# EAGLE design voice_caller (EAGLE 7.7.0)
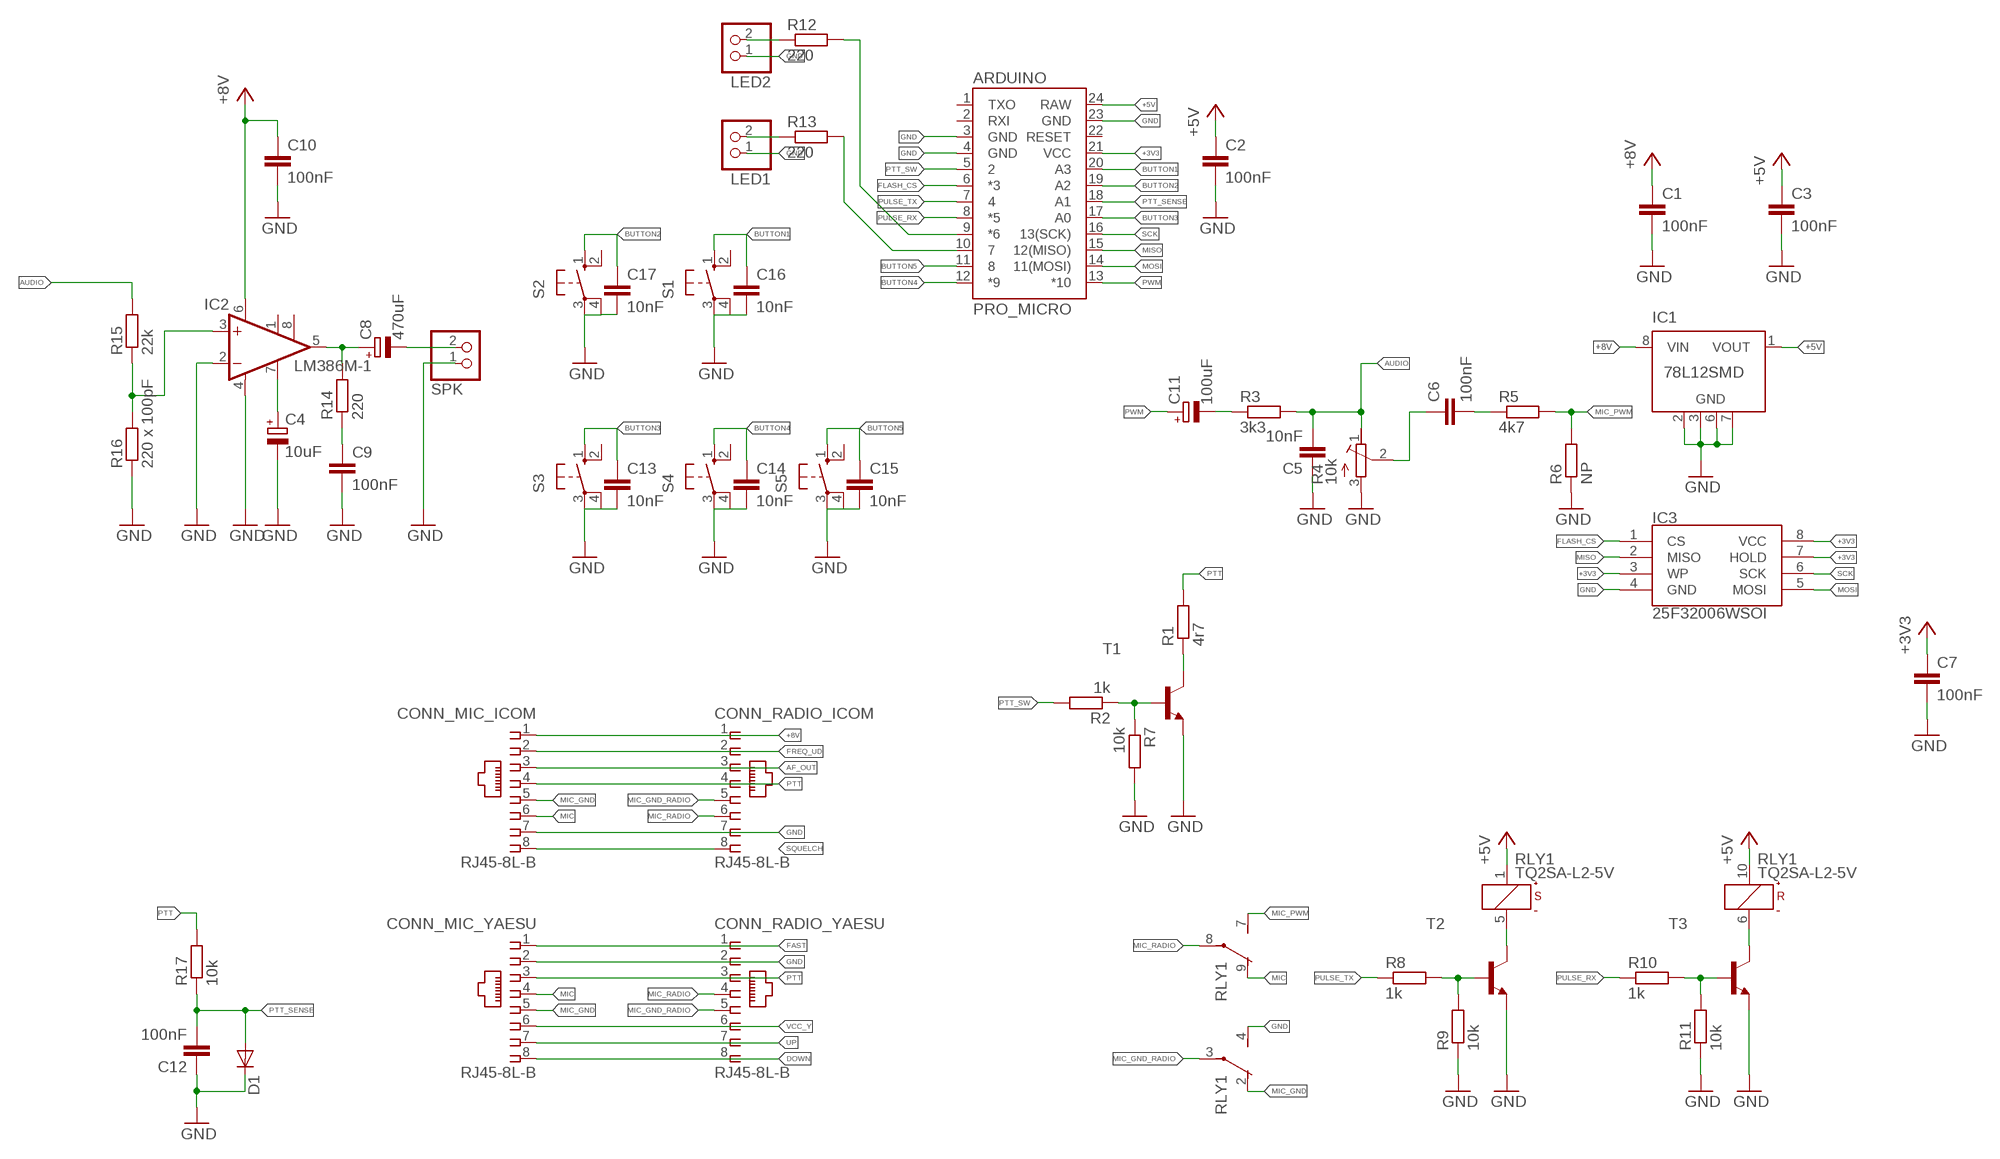
[diagram p0: schematic, sheet 1]

## Parts
ARDUINO  PRO_MICRO  SPARKFUN_PRO_MICRO  [SPARKFUN_PRO_MICRO]
C1  100nF  C-EUC1206K  [C1206K]
C2  100nF  C-EUC1206K  [C1206K]
C3  100nF  C-EUC1206K  [C1206K]
C4  10uF  CPOL-EUE2.5-6  [E2,5-6]
C5  10nF  C-EUC1206K  [C1206K]
C6  100nF  C-EUC1206K  [C1206K]
C7  100nF  C-EUC1206K  [C1206K]
C8  470uF  CPOL-EUE2.5-6  [E2,5-6]
C9  100nF  C-EUC1206K  [C1206K]
C10  100nF  C-EUC1206K  [C1206K]
C11  100uF  CPOL-EUE2.5-6  [E2,5-6]
C12  100nF  C-EUC1206K  [C1206K]
C13  10nF  C-EUC1206K  [C1206K]
C14  10nF  C-EUC1206K  [C1206K]
C15  10nF  C-EUC1206K  [C1206K]
C16  10nF  C-EUC1206K  [C1206K]
C17  10nF  C-EUC1206K  [C1206K]
CONN_MIC_ICOM  RJ45-8L-B  [RJ45-NO-SHIELD]
CONN_MIC_YAESU  RJ45-8L-B  [RJ45-NO-SHIELD]
CONN_RADIO_ICOM  RJ45-8L-B  [RJ45-NO-SHIELD]
CONN_RADIO_YAESU  RJ45-8L-B  [RJ45-NO-SHIELD]
D1  DIODE-SOD80C  [SOD80C]
IC1  78L12SMD  [SO08]
IC2  LM386M-1  [SO08]
IC3  25F32006WSOI  SPI_FLASH-X25XXSMD1  [SO08-EIAJ]
LED1  PINHD-1X2  [1X02]
LED2  PINHD-1X2  [1X02]
R1  4r7  R-EU_M1206  [M1206]
R2  1k  R-EU_M1206  [M1206]
R3  3k3  R-EU_M1206  [M1206]
R4  10k  R-TRIMMT93XB  [RTRIMT93XB]
R5  4k7  R-EU_M1206  [M1206]
R6  NP  R-EU_M1206  [M1206]
R7  10k  R-EU_M1206  [M1206]
R8  1k  R-EU_M1206  [M1206]
R9  10k  R-EU_M1206  [M1206]
R10  1k  R-EU_M1206  [M1206]
R11  10k  R-EU_M1206  [M1206]
R12  220  R-EU_M1206  [M1206]
R13  220  R-EU_M1206  [M1206]
R14  220  R-EU_M1206  [M1206]
R15  22k  R-EU_M1206  [M1206]
R16  220 x 100pF  R-EU_M1206  [M1206]
R17  10k  R-EU_M1206  [M1206]
RLY1  TQ2SA-L2-5V  [TQ-SA]
S1  10-XX  [B3F-10XX]
S2  10-XX  [B3F-10XX]
S3  10-XX  [B3F-10XX]
S4  10-XX  [B3F-10XX]
S5  10-XX  [B3F-10XX]
SPK  PINHD-1X2  [1X02]
T1  MMBT3904LT1-NPN-SOT23-BEC  [SOT23-BEC]
T2  MMBT3904LT1-NPN-SOT23-BEC  [SOT23-BEC]
T3  MMBT3904LT1-NPN-SOT23-BEC  [SOT23-BEC]

## Nets
+3V3: ARDUINO.21(VCC) C7.1 IC3.3(WP) IC3.7(HOLD) IC3.8(VCC)
+5V: ARDUINO.24(RAW) C2.1 C3.1 IC1.1(VOUT) RLY1.1(S:+) RLY1.10(R:+)
+8V: C1.1 C10.1 CONN_MIC_ICOM.1 CONN_RADIO_ICOM.1 IC1.8(VIN) IC2.6(VS)
AF_OUT: CONN_MIC_ICOM.3 CONN_RADIO_ICOM.3
AUDIO: C5.2 R3.2 R4.1(E) R15.2
BUTTON1: ARDUINO.20(A3) C16.1 S1.1(S)
BUTTON2: ARDUINO.19(A2) C17.1 S2.1(S)
BUTTON3: ARDUINO.17(A0) C13.1 S3.1(S)
BUTTON4: ARDUINO.12(*9) C14.1 S4.1(S)
BUTTON5: ARDUINO.11 C15.1 S5.1(S)
DOWN: CONN_MIC_YAESU.8 CONN_RADIO_YAESU.8
FAST: CONN_MIC_YAESU.1 CONN_RADIO_YAESU.1
FLASH_CS: ARDUINO.6(*3) IC3.1(CS)
FREQ_UD: CONN_MIC_ICOM.2 CONN_RADIO_ICOM.2
GND: ARDUINO.3(GND) ARDUINO.4(GND) ARDUINO.23(GND) C1.2 C2.2 C3.2 C4.- C5.1 C7.2 C9.2 C10.2 C12.1 C13.2 C14.2 C15.2 C16.2 C17.2 CONN_MIC_ICOM.7 CONN_MIC_YAESU.2 CONN_RADIO_ICOM.7 CONN_RADIO_YAESU.2 D1.C IC1.2(GND) IC1.3(GND) IC1.6(GND) IC1.7(GND) IC2.2(-IN) IC2.4(GND) IC3.4(GND) LED1.1 LED2.1 R4.3(A) R6.1 R7.2 R9.1 R11.1 R16.1 RLY1.4(1:S) S1.3(P) S1.4(P1) S2.3(P) S2.4(P1) S3.3(P) S3.4(P1) S4.3(P) S4.4(P1) S5.3(P) S5.4(P1) SPK.1 T1.E T2.E T3.E
MIC: CONN_MIC_ICOM.6 CONN_MIC_YAESU.4 RLY1.9(2:O)
MIC_GND: CONN_MIC_ICOM.5 CONN_MIC_YAESU.5 RLY1.2(1:O)
MIC_GND_RADIO: CONN_RADIO_ICOM.5 CONN_RADIO_YAESU.5 RLY1.3(1:P)
MIC_PWM: R5.2 R6.2 RLY1.7(2:S)
MIC_RADIO: CONN_RADIO_ICOM.6 CONN_RADIO_YAESU.4 RLY1.8(2:P)
MISO: ARDUINO.15(12(MISO)) IC3.2(MISO)
MOSI: ARDUINO.14(11(MOSI)) IC3.5(MOSI)
N$1: C11.- R3.1
N$2: IC2.3(+IN) R15.1 R16.2
N$3: C6.2 R5.1
N$4: LED2.2 R12.1
N$5: R2.1 R7.1 T1.B
N$6: C6.1 R4.2(S)
N$7: C4.+ IC2.7(BYPASS)
N$8: R1.1 T1.C
N$9: LED1.2 R13.1
N$10: RLY1.5(S:-) T2.C
N$11: R8.2 R9.2 T2.B
N$12: ARDUINO.9(*6) R12.2
N$13: RLY1.6(R:-) T3.C
N$14: R10.2 R11.2 T3.B
N$15: ARDUINO.10 R13.2
N$16: C8.+ IC2.5(OUT) R14.2
N$21: C9.1 R14.1
N$22: C8.- SPK.2
PTT: CONN_MIC_ICOM.4 CONN_MIC_YAESU.3 CONN_RADIO_ICOM.4 CONN_RADIO_YAESU.3 R1.2 R17.2
PTT_SENSE: ARDUINO.18(A1) C12.2 D1.A R17.1
PTT_SW: ARDUINO.5 R2.2
PULSE_RX: ARDUINO.8(*5) R10.1
PULSE_TX: ARDUINO.7 R8.1
PWM: ARDUINO.13(*10) C11.+
SCK: ARDUINO.16(13(SCK)) IC3.6(SCK)
SQUELCH: CONN_MIC_ICOM.8 CONN_RADIO_ICOM.8
UP: CONN_MIC_YAESU.7 CONN_RADIO_YAESU.7
VCC_Y: CONN_MIC_YAESU.6 CONN_RADIO_YAESU.6
Unconnected: ARDUINO.1(TXO) ARDUINO.2(RXI) ARDUINO.22(RESET) IC1.4(NC) IC1.5(NC) IC2.1(GAIN) IC2.8(GAIN) S1.2(S1) S2.2(S1) S3.2(S1) S4.2(S1) S5.2(S1)

## Library data of the parts
ARDUINO = SparkFun-Boards:SPARKFUN_PRO_MICRO: SparkFun Pro Micro Atmega32U4 compatible footprint. SparkFun Products: 3.3V/8MHz <https://www.sparkfun.com/products/12587> 5V/16MHz <https://www.sparkfun.com/products/12640>
C1-C3 C5-C7 C9 C10 C12-C17 = rcl:C-EU: CAPACITOR, European symbol
C4 C8 C11 = rcl:CPOL-EU: POLARIZED CAPACITOR, European symbol
CONN_MIC_ICOM CONN_MIC_YAESU CONN_RADIO_ICOM CONN_RADIO_YAESU = con-tycoelectronics:RJ45: CORCOM Modular RJ Jacks No Shield Source: www.tycoelectronics.com .. ENG_DS_1654001_1099_RJ_L_0507.pdf; MF: TYCO ELECTRONICS; MPN: RJ45-8L-B; OC_FARNELL: 1279843; OC_NEWARK: 52K4445
D1 = diode:DIODE-: DIODE
IC1 = linear:78L*SMD: Positive VOLTAGE REGULATOR
IC2 = linear:LM386?-*: Low Voltage Audio Power Amplifier Source: http://cache.national.com/ds/LM/LM386.pdf
IC3 = SparkFun-IC-Memory:SPI_FLASH-X25XX: 32M Serial Flash Memory 8pin SPI Flash series x25xx. Works with devices like W25X32 and BR25L32 Datasheet <http://www.macronix.com/Lists/Datasheet/Attachments/5031/MX25L3206E,%203V,%2032Mb,%20v1.5.pdf> SparkFun Products SparkFun Venus GPS Logger <https://www.sparkfun.com/products/10920> (GPS-10920); PROD_ID: IC-09109
LED1 LED2 SPK = pinhead:PINHD-1X2: PIN HEADER
R1-R3 R5-R17 = rcl:R-EU_: RESISTOR, European symbol
R4 = rcl:R-TRIMM: Trimm resistor
RLY1 = relay:TQ2?-L2-*: LOW PROFILE 2 FORM C RELAY NAiS 2 coil latching Source: http://www.mew-europe.com/.. en_ds_61020_0001.pdf Source: http://www.mew-europe.com/.. en_ds_61020_0002.pdf; MF: AROMAT/ MATSUSHITA; MPN: TQ2SA-L2-5V; OC_FARNELL: 625760; OC_NEWARK: 64K3202
S1-S5 = switch-omron:10-XX: OMRON SWITCH; MPN: B3F-1000; OC_FARNELL: 176432; OC_NEWARK: 36M3542
T1-T3 = transistor:*-NPN-: NPN Transistror BF959 corrected 2008.03.06

## Board
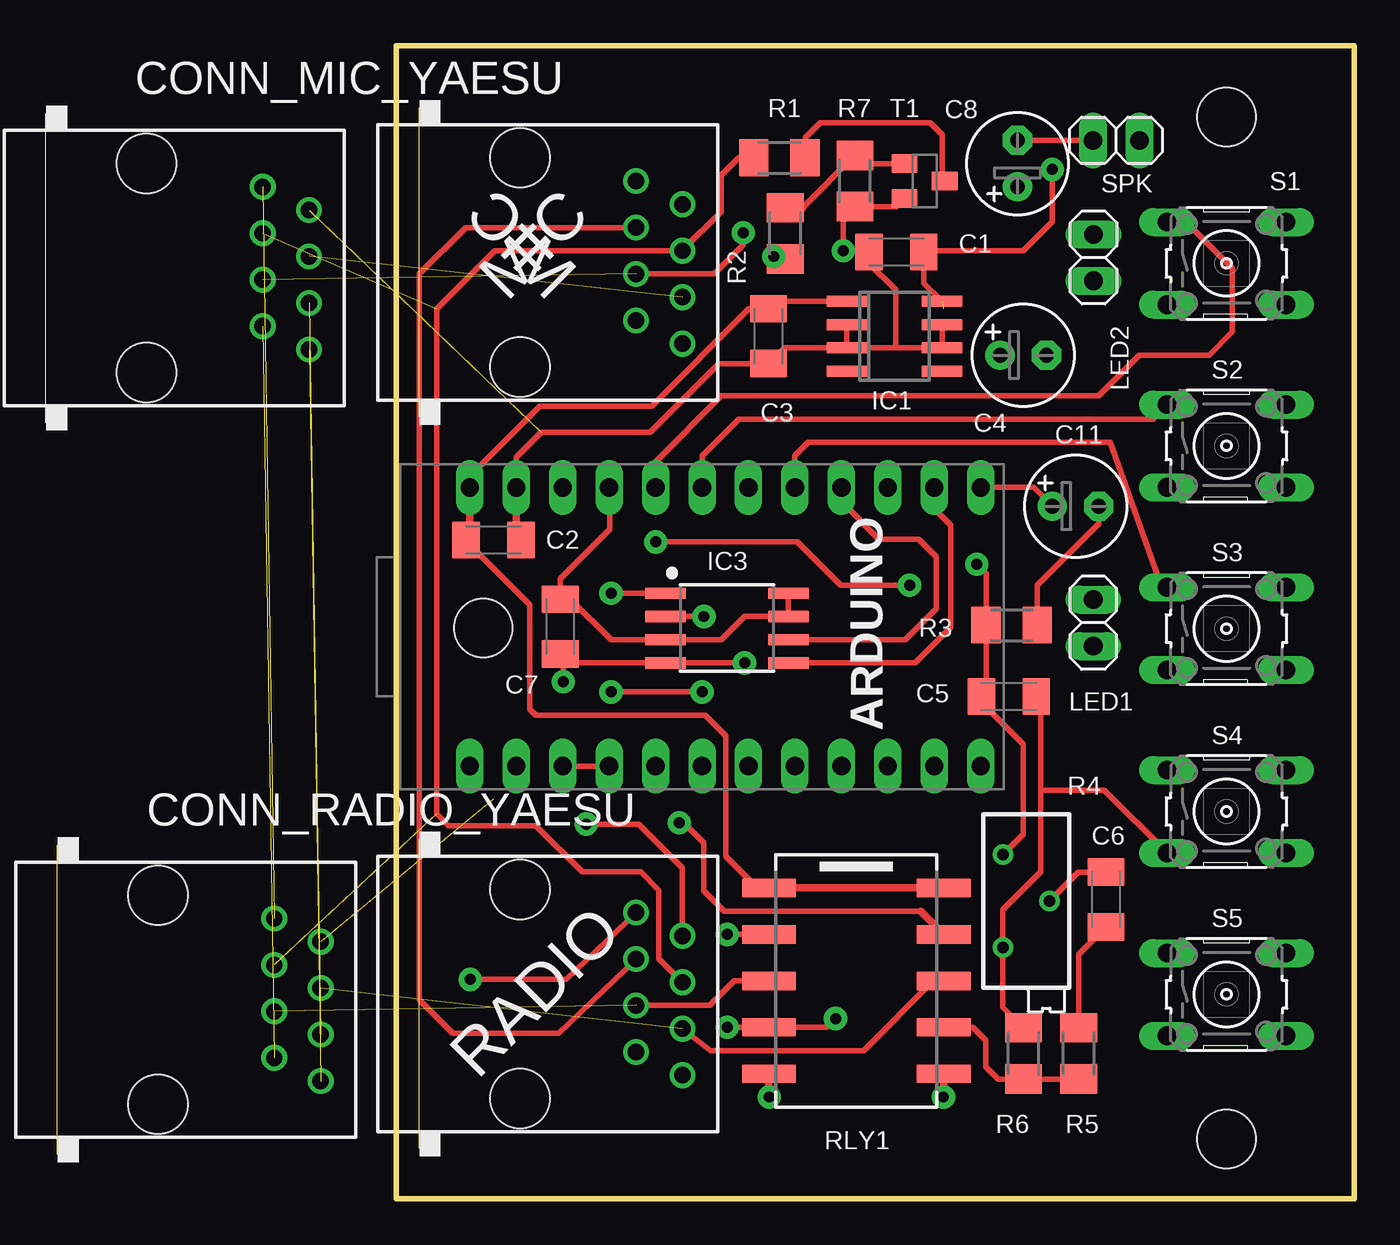
[diagram p1: board, top side]
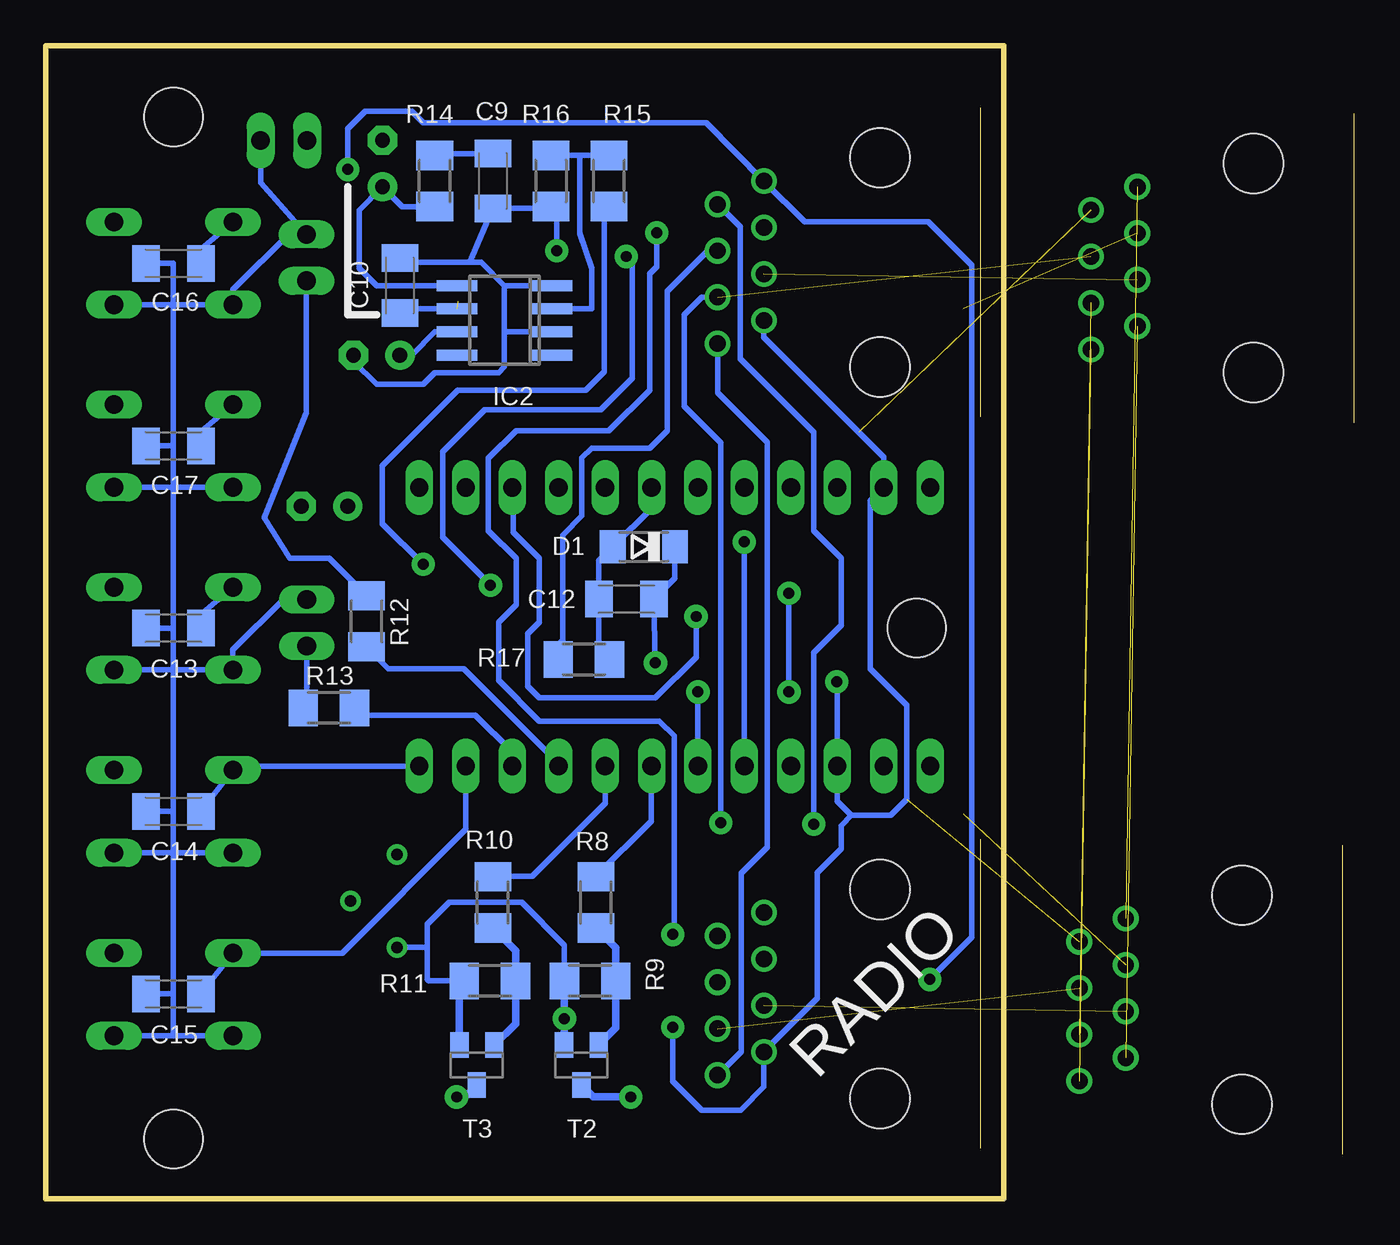
[diagram p2: board, bottom side, seen from below]

Size 52.39 x 63.05 mm. Coordinates in mm from the lower left corner, seen from the top.
Outline: 0,63.05 0,0 52.39,0 52.39,63.05 0,63.05
Copper layers (1*16): Top 0.035mm / dielectric 1.5mm / Bottom 0.035mm
Design rules "default *": minimum track width 10mil, minimum drill 0.6mm, track to track 8mil, track to pad 8mil, pad to pad 8mil, via to via 8mil, smd to smd 0mil, copper to edge 20mil, drill to drill 8mil, minimum pad ring 10mil, minimum via ring 8mil, stop-mask expansion 4mil, vias tented up to drill 0mil, thermal gap 10mil
Holes 3.2 mm at 45.4,3.27 45.4,59.15 4.76,31.21

### Footprints (pad centres in the part's own frame; a part is rotated, then mirrored left to right if it is on the bottom)
SPARKFUN_PRO_MICRO = drill 1 long: 1 -7.62,12.7; 2 -7.62,10.16; 3 -7.62,7.62; 4 -7.62,5.08; 5 -7.62,2.54; 6 -7.62,0; 7 -7.62,-2.54; 8 -7.62,-5.08; 9 -7.62,-7.62; 10 -7.62,-10.16; 11 -7.62,-12.7; 12 -7.62,-15.24; 13 7.62,-15.24; 14 7.62,-12.7; 15 7.62,-10.16; 16 7.62,-7.62; 17 7.62,-5.08; 18 7.62,-2.54; 19 7.62,0; 20 7.62,2.54; 21 7.62,5.08; 22 7.62,7.62; 23 7.62,10.16; 24 7.62,12.7
C1206K = smd 1.5 x 2: 1 -1.5,0; 2 1.5,0
E2,5-6 = drill 0.813 pad 1.6: + -1.27,0 | drill 0.813 pad 1.6 octagon: - 1.27,0
RJ45-NO-SHIELD = drill 0.9 pad 1.4: 1 -4.445,6.35; 2 -3.175,8.89; 3 -1.905,6.35; 4 -0.635,8.89; 5 0.635,6.35; 6 1.905,8.89; 7 3.175,6.35; 8 4.445,8.89 | hole 3.251: -5.715,0; 5.715,0
SOD80C = smd 1.4 x 1.8: A 1.7,0; C -1.7,0
SO08 = smd 0.6 x 2.2: 1 -1.905,-2.6; 2 -0.635,-2.6; 3 0.635,-2.6; 4 1.905,-2.6; 5 1.905,2.6; 6 0.635,2.6; 7 -0.635,2.6; 8 -1.905,2.6
SO08-EIAJ = smd 0.61 x 2.21: 1 -1.905,-3.378; 2 -0.635,-3.378; 3 0.635,-3.378; 4 1.905,-3.378; 5 1.905,3.353; 6 0.635,3.353; 7 -0.635,3.353; 8 -1.905,3.353
1X02 = drill 1.016 long: 1 -1.27,0; 2 1.27,0
M1206 = smd 1.6 x 2: 1 -1.4,0; 2 1.4,0
RTRIMT93XB = drill 0.61: 1 1.27,-2.54; 2 -1.27,0; 3 1.27,2.54
TQ-SA = smd 1 x 2.94: 1 -5.08,-4.78; 2 -2.54,-4.78; 3 0,-4.78; 4 2.54,-4.78; 5 5.08,-4.78; 6 5.08,4.78; 7 2.54,4.78; 8 0,4.78; 9 -2.54,4.78; 10 -5.08,4.78
B3F-10XX = drill 1.016 long: 1 -3.251,2.261; 2 3.251,2.261; 3 -3.251,-2.261; 4 3.251,-2.261
SOT23-BEC = smd 1 x 1.4: B -0.95,-1.1; C 0,1.1; E 0.95,-1.1

### Placement (x,y rotation side)
ARDUINO  16.72,31.29 90 top
C1  27.35,51.78 180 top
C2  5.33,36.04 0 top
C3  20.36,47.17 270 top
C4  34.29,46.13 0 top
C5  33.5,27.48 180 top
C6  38.81,16.37 270 top
C7  8.97,31.29 270 top
C8  220uF  [E2,5-6]  33.97,56.61 90 top
C9  27.94,55.66 270 bottom
C10  33.02,49.94 90 bottom
C11  220uF  [E2,5-6]  37.15,37.88 0 top
C12  20.64,32.8 180 bottom
C13  45.4,31.21 180 bottom
C14  45.4,21.19 180 bottom
C15  45.4,11.21 180 bottom
C16  45.4,51.15 180 bottom
C17  45.4,41.17 180 bottom
CONN_MIC_ICOM  6.76,51.21 270 top
CONN_MIC_YAESU  -13.65,50.89 270 top  (outside the outline)
CONN_RADIO_ICOM  6.76,11.21 270 top
CONN_RADIO_YAESU  -13.02,10.89 270 top  (outside the outline)
D1  19.69,35.66 180 bottom
IC1  27.25,47.17 270 top
IC2  27.31,48.04 90 bottom
IC3  18.1,31.21 270 top
LED1  38.12,31.5 270 top
LED2  38.13,51.47 270 top
R1  20.96,56.93 180 top
R2  21.27,52.8 270 top
R3  33.66,31.37 180 top
R4  [RTRIMT93XB]  34.45,16.29 180 top
R5  37.32,7.95 270 top
R6  34.31,7.95 270 top
R7  25.08,55.66 270 top
R8  22.3,16.21 270 bottom
R9  22.62,11.92 0 bottom
R10  27.94,16.21 270 bottom
R11  28.1,11.92 0 bottom
R12  34.84,31.59 270 bottom
R13  36.9,26.85 0 bottom
R14  31.12,55.66 270 bottom
R15  21.59,55.66 270 bottom
R16  24.77,55.66 90 bottom
R17  22.96,29.5 180 bottom
RLY1  25.16,11.92 270 top
S1  45.4,51.15 0 top
S2  45.4,41.17 0 top
S3  45.4,31.18 0 top
S4  45.4,21.18 0 top
S5  45.4,11.18 0 top
SPK  39.37,57.88 180 top
T1  28.89,55.66 270 top
T2  23.1,7.32 180 bottom
T3  28.81,7.32 180 bottom

### Tracks (layer width: path | path; a pad name or v marks a point on that pad's centre or on a via)
+3V3
  Top 0.305: ARDUINO.21 11.67,38.88 11.67,36.61 8.97,33.91 C7.1 | 9.53,32.8 11.75,30.57 IC3.3 17.78,30.57 19.05,31.85 IC3.7 IC3.8
  Top 0.406: 9.53,32.8 C7.1
+5V
  Top 0.305: IC1.1 20.76,49.08 C3.1 | ARDUINO.24 4.02,39.52 7.86,43.35 13.97,43.35 19.29,48.67 C3.1 | 20.2,48.51 C3.1 | C2.1 3.83,35.96 7.3,32.48 7.3,26.77 7.62,26.45 16.91,26.45 18.02,25.34 18.02,18.73 19.75,17 RLY1.1
  Top 0.406: C2.1 4.02,36.04 ARDUINO.24 | RLY1.10 RLY1.1
+8V  (via drill 0.6 pad 1.27)  (1 unrouted)
  Top 0.305: v4.05,12 9.29,12 CONN_RADIO_ICOM.1 | IC1.8 28.85,50.08 C1.1 28.92,51.85 34.29,51.85 35.88,53.44 v35.88,56.29
  Bottom 0.305: v4.05,12 1.75,14.3 1.75,51.05 4.13,53.44 10.88,53.44 CONN_MIC_ICOM.1 16.27,58.83 31.75,58.83 32.38,59.47 34.93,59.47 35.88,58.52 v35.88,56.29 | IC2.6 33.43,48.67 C10.1
AF_OUT
  Top 0.305: CONN_RADIO_ICOM.3 8.9,9.06 3.1,9.06 1.27,10.89 1.27,50.58 3.81,53.12 CONN_MIC_ICOM.3
AUDIO  (via drill 0.6 pad 1.27)
  Top 0.305: R4.1 34.29,19.94 34.29,24.86 32.08,27.07 32,27.07 C5.2 32.26,27.74 R3.2 32.26,34.2 v31.75,34.7
  Bottom 0.305: v31.75,34.7 33.97,36.92 33.97,40.1 29.84,44.23 22.86,44.23 21.85,45.24 21.85,54.26 R15.2 21.27,53.94
BUTTON1
  Top 0.305: ARDUINO.20 14.18,40.31 17.78,43.91 38.42,43.91 40.64,46.13 44.45,46.13 45.72,47.4 45.72,50.89 43.18,53.44 42.53,53.44 S1.1 42.5,53.48
  Bottom 0.305: C16.1 44.25,51.67 S1.1
BUTTON2
  Top 0.305: 42.23,42.96 42.54,43.27 42.32,43.27 S2.1 41.36,42.64 18.73,42.64 16.72,40.63 ARDUINO.19
  Bottom 0.305: C17.1 44.23,41.68 S2.1
BUTTON3
  Top 0.305: ARDUINO.17 21.8,40.63 22.54,41.37 39.05,41.37 41.85,33.43 42.47,33.43 S3.1
  Bottom 0.305: C13.1 44.22,31.7 S3.1
BUTTON4
  Bottom 0.305: C14.1 S4.1 41.93,23.66 ARDUINO.12
BUTTON5
  Bottom 0.305: ARDUINO.11 29.42,20.2 36.18,13.44 S5.1 C15.1
DOWN  (1 unrouted)
FAST  (1 unrouted)
FLASH_CS  (via drill 0.6 pad 1.27)
  Top 0.305: IC3.1 v11.75,33.12 | v11.75,27.72 v16.72,27.72
  Bottom 0.305: v16.72,27.72 ARDUINO.6 | v11.75,27.72 v11.75,33.12
FREQ_UD  (via drill 0.6 pad 1.27)
  Top 0.305: v10.4,20.49 13.26,20.49 15.65,18.1 CONN_RADIO_ICOM.2
  Bottom 0.305: v10.4,20.49 10.4,29.86 8.89,31.37 8.89,35.02 10.4,36.53 10.4,41.93 14.41,45.93 14.41,53.15 14.61,53.35 CONN_MIC_ICOM.2
GND  (via drill 0.6 pad 1.27)  (2 unrouted)
  Top 0.305: ARDUINO.3 ARDUINO.4 11.64,23.3 | IC1.7 IC1.6 27.31,46.53 | IC1.2 IC1.3 | 27.31,46.53 IC1.3 | IC1.3 21.22,46.53 C3.2 17.64,45.67 13.89,41.93 7.94,41.93 6.56,40.55 ARDUINO.23 | 27.31,46.53 27.31,49.7 25.85,51.16 C1.2 25.77,51.85 v24.45,51.85 24.45,53.62 R7.2 27.34,54.26 T1.E | 34.37,9.42 R6.1 33.18,10.48 R4.3 33.18,15.81 35.24,17.88 35.24,22.35 | C5.1 34.93,27.41 35.24,27.09 35.24,22.35 | v24.02,9.86 23.55,9.38 RLY1.4 v18.1,9.38 | v9.13,28.27 9.13,29.63 C7.2 | 8.97,29.3 IC3.4 v19.05,29.3 | 35.24,22.35 38.73,22.35 S4.3
  Top 0.406: C2.2 6.56,36.04 ARDUINO.23 | 9.05,29.7 8.97,29.7 C7.2 8.97,29.3 | 20.36,45.54 C3.2
  Bottom 0.305: 8.34,20.97 8.89,20.41 8.89,19.15 10.19,17.84 10.19,10.96 CONN_RADIO_ICOM.7 13.11,6.14 14.4,4.86 16.51,4.86 18.1,6.45 v18.1,9.38 | 8.34,20.97 6.19,20.97 5.32,21.84 5.32,27 7.3,28.99 7.3,38.16 ARDUINO.23 6.56,40.55 13.11,47.1 CONN_MIC_ICOM.7 | R9.1 24.02,13.88 26.35,16.21 30.32,16.21 31.51,15.02 31.51,13.75 | 31.51,13.75 31.51,12 31.43,11.92 R11.1 | v9.13,28.27 9.1,28.25 ARDUINO.3 9.1,21.74 8.34,20.97 | R4.3 31.51,13.75 | S5.3 45.4,8.92 | 45.4,8.92 S5.4 | S4.3 45.4,18.92 | 45.4,18.92 S4.4 | 45.4,28.92 S3.3 42.15,30.02 39.4,32.77 LED1.1 | 45.4,28.92 S3.4 | S2.3 45.4,38.91 | 45.4,38.91 S2.4 | LED2.1 40.64,55.57 SPK.1 | IC2.2 27.31,47.4 | 27.31,47.4 27.31,49.94 | 27.31,49.94 IC2.4 | 29.21,51.21 33.43,51.21 C10.2 | 29.21,51.21 28.58,51.21 27.31,49.94 | 38.1,52.77 LED2.1 | 29.21,51.21 C9.2 24.87,54.16 R16.1 24.45,53.94 v24.45,51.85 | C4.- 35.56,45.81 34.29,44.55 31.75,44.55 31.12,45.18 27.62,45.18 27.31,45.5 27.31,47.4 | v19.05,29.3 C12.1 17.99,33.95 D1.C | 45.72,31.21 C13.2 45.4,31.21 | C16.2 45.4,51.16 45.4,48.89 | 45.72,21.19 C14.2 45.4,21.19 | C15.2 45.4,11.21 | 45.4,11.21 45.4,8.92 | 45.4,11.21 45.4,18.92 | 45.4,18.92 45.4,21.19 | 45.4,21.19 45.4,28.92 | 45.4,31.21 45.4,38.91 | 45.4,41.17 45.4,48.89 | 45.4,48.89 S1.4 S1.3 42.15,49.7 39.05,52.8 38.19,52.8 LED2.1 | C17.2 45.4,41.17 | 45.4,41.17 45.4,38.91 | 45.4,31.21 45.4,28.92
  Bottom 0.406: T2.E 24.02,8.44 v24.02,9.86 R9.1 | R11.1 29.76,11.66 T3.E | 42.32,38.91 S2.3
MIC  (via drill 0.6 pad 1.27)  (1 unrouted)
  Top 0.305: 28.67,15.73 17.94,15.73 16.83,16.84 16.83,19.46 15.72,20.57 v15.48,20.57
  Top 0.406: RLY1.9 28.67,15.73
  Bottom 0.305: v15.48,20.57 15.47,21.53 15.47,41.36 17.46,43.35 17.46,48.36 16.51,49.3 CONN_MIC_ICOM.6
MIC_GND  (via drill 0.6 pad 1.27)  (1 unrouted)
  Top 0.305: v18.1,14.46 RLY1.2 | 18.98,52.39 v18.98,52.82 18.98,52.16 17.39,50.58 CONN_MIC_ICOM.5
  Bottom 0.305: v18.98,52.82 18.98,50.96 19.37,50.58 19.37,44.23 21.59,42.01 26.67,42.01 28.18,40.5 28.18,36.53 26.67,35.02 26.67,32.48 27.62,31.53 27.62,28.35 25.4,26.13 18.83,26.13 18.02,25.32 18.02,14.54 v18.1,14.46
MIC_GND_RADIO  (1 unrouted)
  Top 0.305: CONN_RADIO_ICOM.5 17.15,10.57 18.49,11.92 RLY1.3
MIC_PWM
  Top 0.305: R5.2 R6.2 32.91,6.55 32.23,7.24 32.23,8.67 31.51,9.38 RLY1.7
MIC_RADIO  (1 unrouted)
  Top 0.305: CONN_RADIO_ICOM.6 17.21,8.11 25.56,8.11 29.37,11.92 RLY1.8
MISO  (via drill 0.6 pad 1.27)
  Top 0.305: IC3.2 v16.83,31.85
  Bottom 0.305: ARDUINO.15 26.83,38.85 26.83,36.45 25.4,35.02 25.4,31.53 26.04,30.89 26.04,28.04 25.4,27.4 19.05,27.4 16.83,29.62 v16.83,31.85
MOSI
  Top 0.305: 29.42,38.45 ARDUINO.14 29.42,37.75 30.32,36.85 30.32,31.25 28.38,29.3 IC3.5
N$1
  Top 0.305: R3.1 35.06,33.56 38.42,36.92 C11.-
N$2
  Bottom 0.305: R15.1 23.18,57.06 | 23.18,57.06 R16.2 | IC2.3 22.54,48.67 22.54,50.89 23.18,52.8 23.18,57.06
N$3
  Top 0.305: C6.2 37.32,13.38 R5.1
N$4
  Bottom 0.305: LED2.2 38.13,42.99 40.44,37.24 39.05,35.02 36.88,35.02 R12.1
N$5
  Top 0.305: 22.23,54.2 R7.1 | T1.B 25.53,56.61
  Top 0.406: R2.1 22.23,54.2 | 25.53,56.61 R7.1
N$6
  Top 0.305: R4.2 37.3,17.87 C6.1
N$7
  Bottom 0.305: IC2.7 31.12,47.4 32.38,46.13 C4.+
N$8
  Top 0.305: R1.1 22.36,58.01 23.18,58.83 29.21,58.83 29.84,58.2 29.84,55.8
  Top 0.406: 29.84,55.8 T1.C
N$9
  Bottom 0.305: LED1.2 38.11,27.03 R13.1
N$10  (via drill 0.6 pad 1.27)
  Top 0.406: v20.4,5.57 20.38,5.59 RLY1.5
  Bottom 0.406: T2.C 22.45,5.57 v20.4,5.57
N$11
  Bottom 0.406: T2.B 21.22,9.34 R9.2 21.22,13.73 R8.2
N$12
  Bottom 0.305: ARDUINO.9 24.34,23.8 29.53,28.99 33.65,28.99 R12.2
N$13  (via drill 0.6 pad 1.27)
  Top 0.406: v29.92,5.57 29.94,5.59 RLY1.6
  Bottom 0.406: T3.C 29.46,5.57 v29.92,5.57
N$14
  Bottom 0.406: T3.B 26.7,9.58 R11.2 26.7,13.57 R10.2
N$15
  Bottom 0.305: ARDUINO.10 26.88,24.44 28.89,26.45 35.1,26.45 R13.2
N$16
  Bottom 0.305: IC2.5 34.29,49.94 35.24,50.89 35.24,54.07 C8.+ 32.89,54.26 R14.2
N$21
  Bottom 0.305: C9.1 31.02,57.16 R14.1
N$22
  Top 0.305: C8.- SPK.2
PTT  (2 unrouted)
  Top 0.305: R1.2 18.73,56.93 17.78,55.98 17.78,53.99 CONN_MIC_ICOM.4 5.39,51.84 2.22,48.67 2.22,21.05 2.86,20.41 7.62,20.41 10.16,17.88 13.37,17.88 14.36,16.88 14.36,13.14 CONN_RADIO_ICOM.4
  Top 0.406: R1.2 19.24,57.25
  Bottom 0.305: R17.2 24.36,30.31 24.13,30.54 24.13,36.29 23.08,37.34 23.08,40.52 22.54,41.05 19.37,41.05 18.41,42.01 18.41,49.62 16.2,51.84 CONN_MIC_ICOM.4
PTT_SENSE
  Bottom 0.305: R17.1 22.14,30.08 C12.2 22.14,34.9 D1.A 19.26,37.78 ARDUINO.18
PTT_SW  (via drill 0.6 pad 1.27)
  Top 0.305: v28.07,33.55 24.31,33.55 21.94,35.92 v14.19,35.92 | R2.2 20.77,51.4 v20.64,51.53
  Bottom 0.305: ARDUINO.5 v14.18,35.92 v14.19,35.92 | v28.07,33.55 28.05,33.55 30.67,36.17 30.67,40.86 28.42,43.12 28.42,43.14 22.04,43.14 20.32,44.86 20.32,51.21 v20.64,51.53
PULSE_RX
  Bottom 0.305: ARDUINO.8 21.8,21.63 25.8,17.64 27.91,17.64 R10.1
PULSE_TX
  Bottom 0.305: ARDUINO.7 19.29,23.64 19.29,20.65 22.3,17.64 R8.1
PWM
  Top 0.305: ARDUINO.13 34.85,38.91 C11.+
SCK
  Top 0.305: ARDUINO.16 24.32,38.88 24.32,38.15 26.4,36.07 28.56,36.07 29.53,35.11 29.53,32.28 27.83,30.57 IC3.6
SQUELCH
  Bottom 0.305: CONN_MIC_ICOM.8 15.65,44.08 12.94,41.37 12.94,19.22 14.36,17.8 14.36,8.06 CONN_RADIO_ICOM.8
UP  (1 unrouted)
VCC_Y  (1 unrouted)

### Text on the board
tNames: MIC | MIC | RADIO
bNames: RADIO